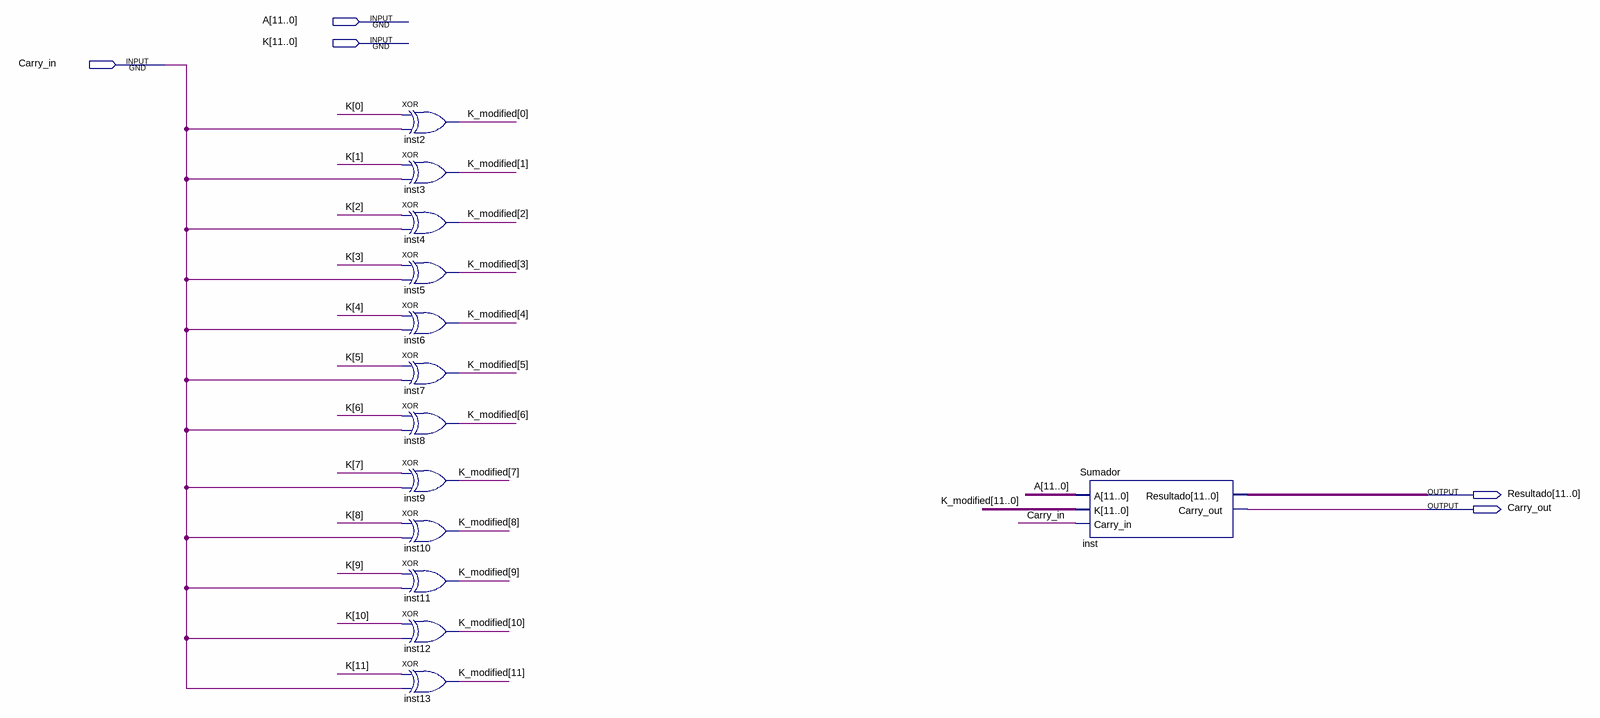
[diagram p0: schematic sheet]
// Quartus schematic SumRes.bdf as structural Verilog: 13 symbols, 5 pins
module SumRes (
  input  [11:0] A,
  input  [11:0] K,
  input  Carry_in,
  output [11:0] Resultado,
  output Carry_out
);

  wire [11:0] K_modified;

  xor inst2 (K_modified[0], K[0], Carry_in);
  xor inst3 (K_modified[1], K[1], Carry_in);
  xor inst4 (K_modified[2], K[2], Carry_in);
  xor inst5 (K_modified[3], K[3], Carry_in);
  xor inst6 (K_modified[4], K[4], Carry_in);
  xor inst7 (K_modified[5], K[5], Carry_in);
  xor inst8 (K_modified[6], K[6], Carry_in);
  xor inst9 (K_modified[7], K[7], Carry_in);
  xor inst10 (K_modified[8], K[8], Carry_in);
  xor inst11 (K_modified[9], K[9], Carry_in);
  xor inst12 (K_modified[10], K[10], Carry_in);
  xor inst13 (K_modified[11], K[11], Carry_in);
  Sumador inst (.A(A), .K(K_modified), .Carry_in(Carry_in), .Resultado(Resultado), .Carry_out(Carry_out));
endmodule
